# EAGLE design communication (EAGLE 5.06)
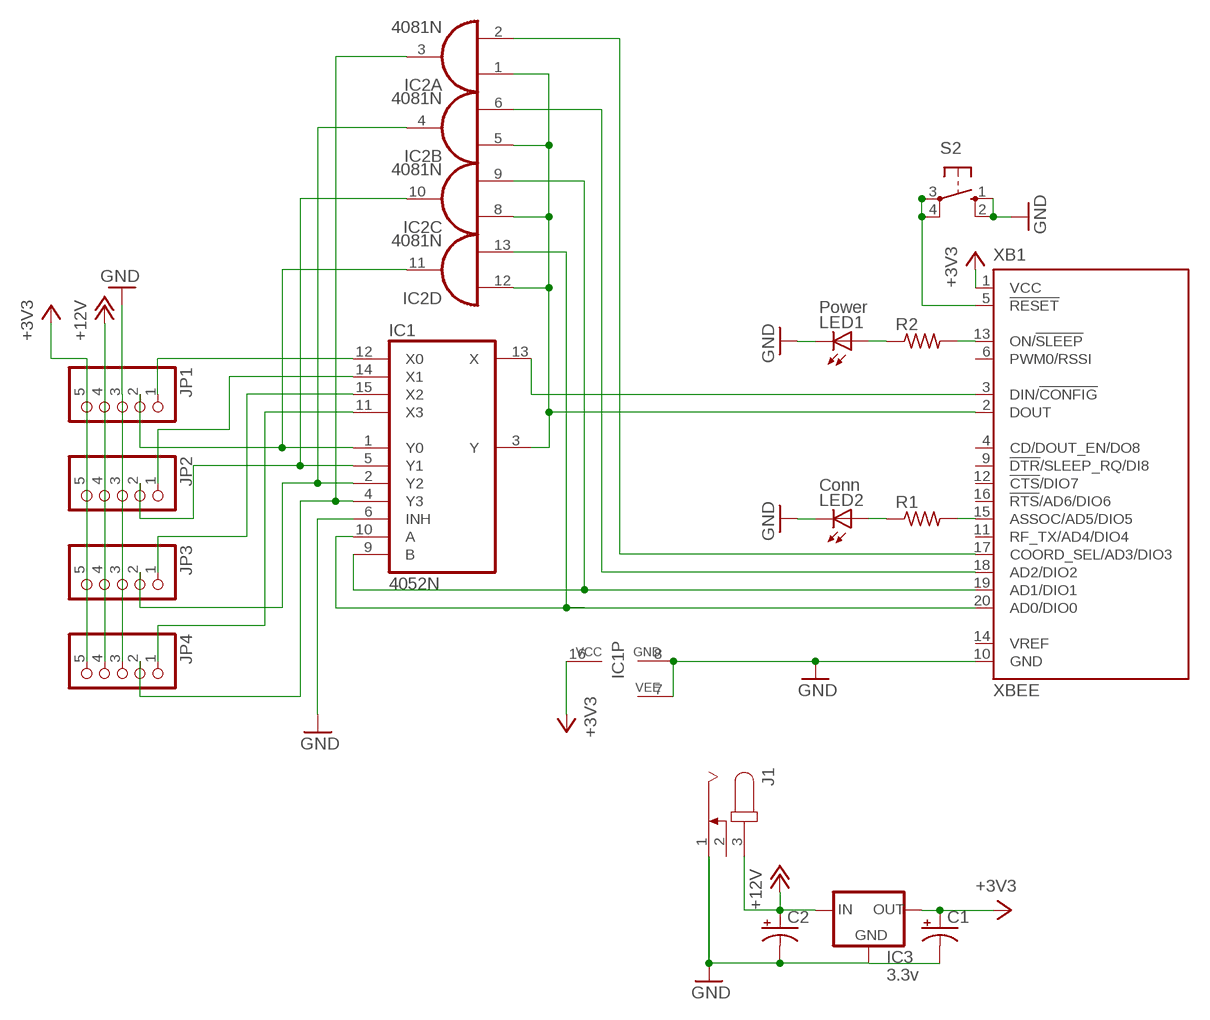
[diagram p0: schematic, sheet 1]

## Parts
C1  CPOL-USE2.5-5  [E2,5-5]
C2  CPOL-USE2.5-5  [E2,5-5]
IC1  4052N  [DIL16]
IC2  4081N  [DIL14]
IC3  3.3v  78XXS  [78XXS]
J1  JACK-PLUG1  [SPC4078]
JP1  PINHD-1X5  [1X05]
JP2  PINHD-1X5  [1X05]
JP3  PINHD-1X5  [1X05]
JP4  PINHD-1X5  [1X05]
LED1  Power  LED3MM  [LED3MM]
LED2  Conn  LED3MM  [LED3MM]
R1  R-US_0309/12  [0309/12]
R2  R-US_0309/12  [0309/12]
S2  10-XX  [B3F-10XX]
XB1  XBEE  [XBEE]

## Nets
+3V3: C1.+ IC1.16(VCC) IC3.OUT JP1.5 JP2.5 JP3.5 JP4.5 XB1.1(VCC)
+12V: C2.+ IC3.IN J1.3 JP1.4 JP2.4 JP3.4 JP4.4
GND: C1.- C2.- IC1.6(INH) IC1.7(VEE) IC1.8(GND) IC3.GND J1.1 JP1.3 JP2.3 JP3.3 JP4.3 LED1.K(C) LED2.K(C) S2.1(S) S2.2(S1) XB1.10(GND)
N$1: IC2.6(B:I1) XB1.18(AD2/DIO2)
N$3: IC1.12(X0) JP1.1
N$4: R1.2 XB1.15(ASSOC/AD5/DIO5)
N$5: LED2.A R1.1
N$6: R2.2 XB1.13(ON/!SLEEP)
N$7: LED1.A R2.1
N$8: S2.3(P) S2.4(P1) XB1.5(!RESET)
N$9: IC1.14(X1) JP2.1
N$11: IC1.15(X2) JP3.1
N$12: IC1.11(X3) JP4.1
N$13: IC1.5(Y1) IC2.10(C:O) JP2.2
N$14: IC1.1(Y0) IC2.11(D:O) JP1.2
N$15: IC1.2(Y2) IC2.4(B:O) JP3.2
N$16: IC1.4(Y3) IC2.3(A:O) JP4.2
N$17: IC1.13(X) XB1.3(DIN/!CONFIG)
N$18: IC1.3(Y) IC2.1(A:I0) IC2.5(B:I0) IC2.8(C:I0) IC2.12(D:I0) XB1.2(DOUT)
N$19: IC1.9(B) IC2.9(C:I1) XB1.19(AD1/DIO1)
N$20: IC1.10(A) IC2.13(D:I1) XB1.20(AD0/DIO0)
N$21: IC2.2(A:I1) XB1.17(COORD_SEL/AD3/DIO3)
Unconnected: J1.2 XB1.4(CD/DOUT_EN/DO8) XB1.6(PWM0/RSSI) XB1.9(!DTR!/SLEEP_RQ/DI8) XB1.11(RF_TX/AD4/DIO4) XB1.12(!CTS!/DIO7) XB1.14(VREF) XB1.16(!RTS!/AD6/DIO6)

## Power pins joined to a net without a drawn wire
VDD: IC2.14(P:VDD)
VSS: IC2.7(P:VSS)

## Library data of the parts
C1 C2 = rcl:CPOL-US: POLARIZED CAPACITOR, American symbol
IC1 = 40xx:4052: Dual 4-channel ANALOG MULTIPLEXER
IC2 = 40xx:4081: Quad 2-input AND
IC3 = v-reg:78XXS: VOLTAGE REGULATOR
J1 = con-jack:JACK-PLUG: DC POWER JACK Power Jack, DC, Right Angle, Through Hole, Rated 5A at 16VDC, PC Terminals Distributor: Farnell (www.Farnell.de) Drawing: 84N1161.pdf / 84N1162.pdf Manufacturer: SPC Technology (www.spctechnology.com) Type: SPC4077 / SPC 4078
JP1-JP4 = pinhead:PINHD-1X5: PIN HEADER
LED1 LED2 = led:LED: LED OSRAM: - CHIPLED LG R971, LG N971, LY N971, LG Q971, LY Q971, LO R971, LY R971 LH N974, LH R974 LS Q976, LO Q976, LY Q976 LO Q996 - Hyper CHIPLED LW Q18S LB Q993, LB Q99A, LB R99A - SideLED LS A670, LO A670, LY A670, LG A670, LP A670 LB A673, LV A673, LT A673, LW A673 LH A674 LY A675 LS A676, LA A676, LO A676, LY A676, LW A676 LS A679, LY A679, LG A679 - Hyper Micro SIDELED® LS Y876, LA Y876, LO Y876, LY Y876 LT Y87S - SmartLED LW L88C, LW L88S LB L89C, LB L89S, LG L890 LS L89K, LO L89K, LY L89K LS L896, LA L896, LO L896, LY L896 - TOPLED LS T670, LO T670, LY T670, LG T670, LP T670 LSG T670, LSP T670, LSY T670, LOP T670, LYG T670 LG T671, LOG T671, LSG T671 LB T673, LV T673, LT T673, LW T673 LH T674 LS T676, LA T676, LO T676, LY T676, LB T676, LH T676, LSB T676, LW T676 LB T67C, LV T67C, LT T67C, LS T67K, LO T67K, LY T67K, LW E67C LS E67B, LA E67B, LO E67B, LY E67B, LB E67C, LV E67C, LT E67C LW T67C LS T679, LY T679, LG T679 LS T770, LO T770, LY T770, LG T770, LP T770 LB T773, LV T773, LT T773, LW T773 LH T774 LS E675, LA E675, LY E675, LS T675 LS T776, LA T776, LO T776, LY T776, LB T776 LHGB T686 LT T68C, LB T68C - Hyper Mini TOPLED® LB M676 - Mini TOPLED Santana® LG M470 LS M47K, LO M47K, LY M47K Source: http://www.osram.convergy.de LUXEON: - LUMILED® LXK2-PW12-R00, LXK2-PW12-S00, LXK2-PW14-U00, LXK2-PW14-V00 LXK2-PM12-R00, LXK2-PM12-S00, LXK2-PM14-U00 LXK2-PE12-Q00, LXK2-PE12-R00, LXK2-PE12-S00, LXK2-PE14-T00, LXK2-PE14-U00 LXK2-PB12-K00, LXK2-PB12-L00, LXK2-PB12-M00, LXK2-PB14-N00, LXK2-PB14-P00, LXK2-PB14-Q00 LXK2-PR12-L00, LXK2-PR12-M00, LXK2-PR14-Q00, LXK2-PR14-R00 LXK2-PD12-Q00, LXK2-PD12-R00, LXK2-PD12-S00 LXK2-PH12-R00, LXK2-PH12-S00 LXK2-PL12-P00, LXK2-PL12-Q00, LXK2-PL12-R00 Source: www.luxeon.com KINGBRIGHT: KA-3528ASYC Source: www.kingbright.com
R1 R2 = resistor:R-US_: RESISTOR, American symbol
S2 = switch-omron:10-XX: OMRON SWITCH
XB1 = maxstream:XBEE: XBee (TM) /XBee-PRO(TM) OEM RF Modules Source: MaxStream, Inc. xbee_productmanual.pdf

## Board
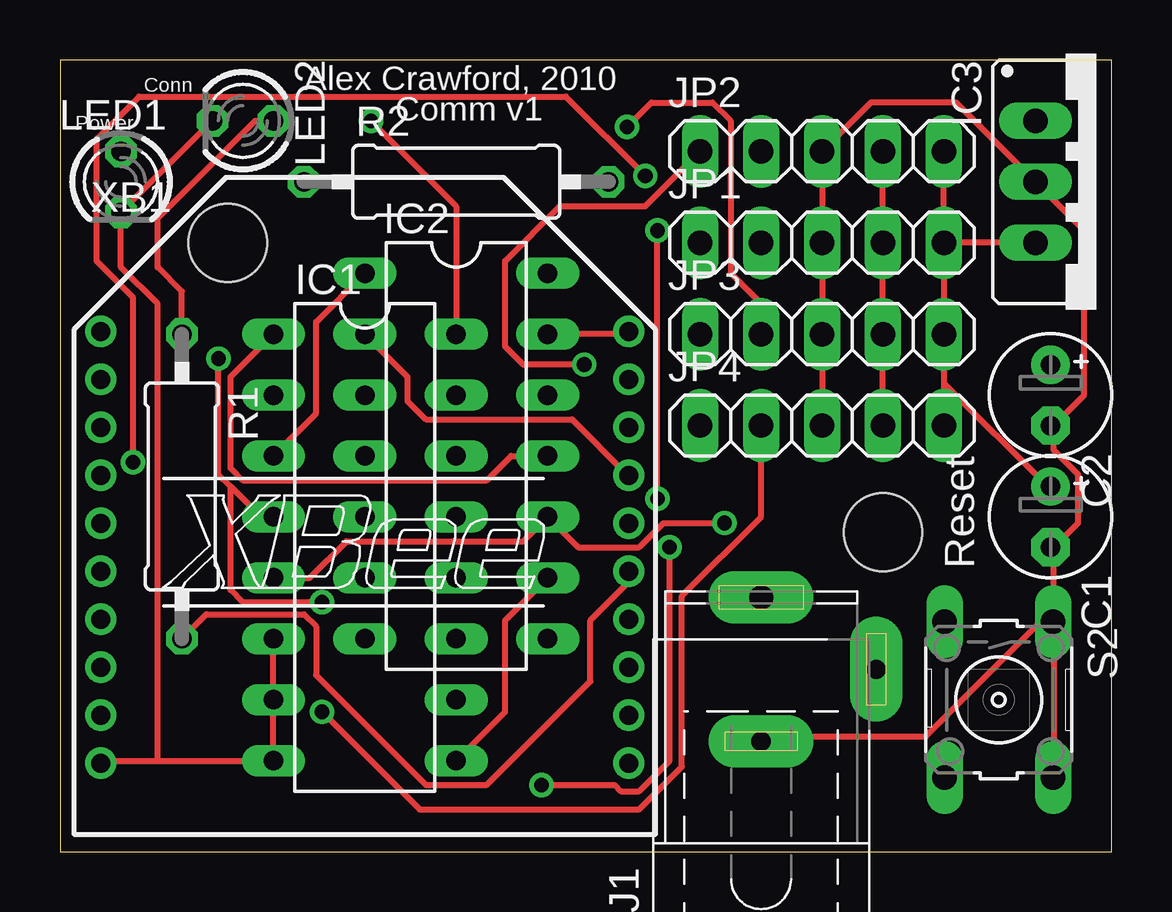
[diagram p1: board, top side]
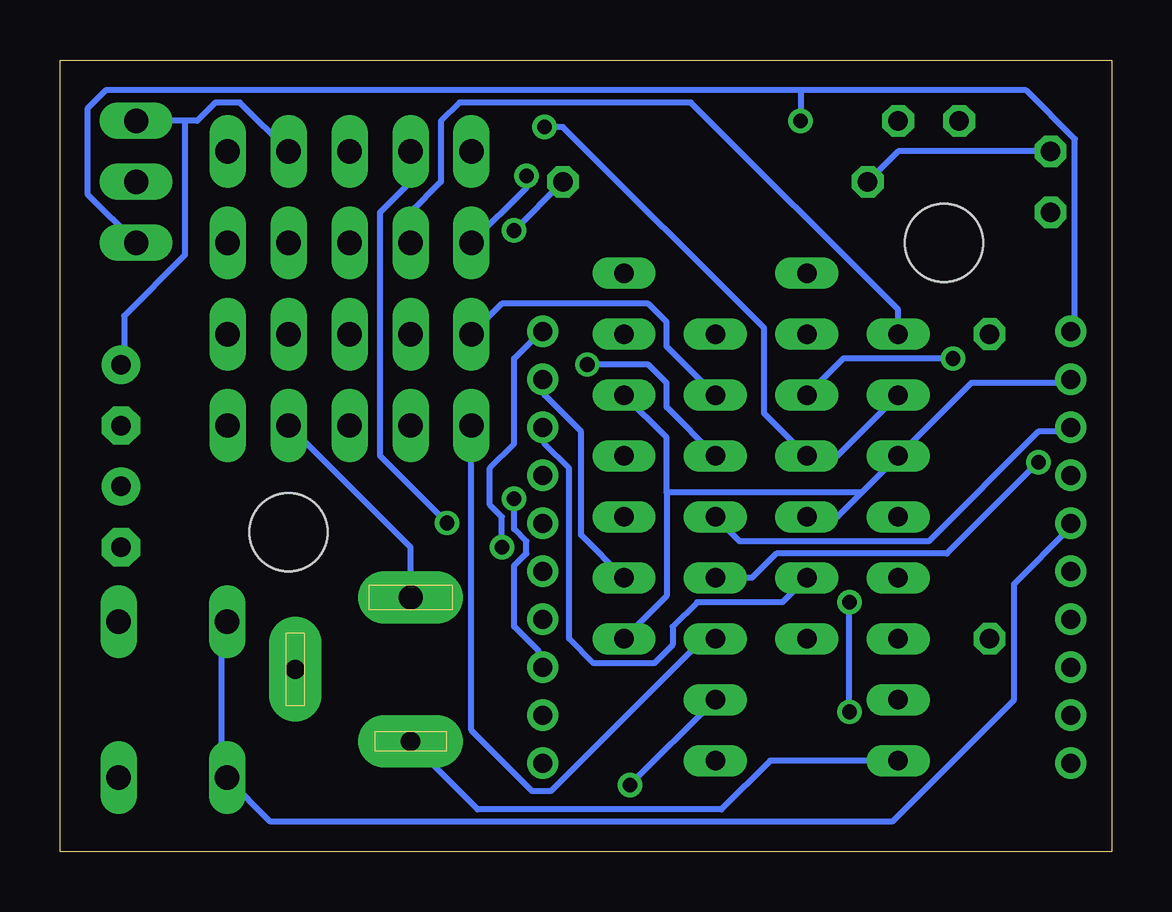
[diagram p2: board, bottom side, seen from below]

Size 43.81 x 33.02 mm. Coordinates in mm from the lower left corner, seen from the top.
Outline: 0,0 43.81,0 43.81,33.02 0,33.02 0,0
Copper layers (1*16): Top 0.035mm / dielectric 1.5mm / Bottom 0.035mm
Design rules "default": minimum track width 10mil, minimum drill 24mil, track to track 8mil, track to pad 8mil, pad to pad 8mil, via to via 8mil, smd to smd 8mil, copper to edge 40mil, drill to drill 8mil, minimum pad ring 10mil, minimum via ring 8mil, stop-mask expansion 4mil, vias tented up to drill 0mil, thermal gap 10mil
Holes 3.26 mm at 6.99,25.4 34.29,13.34

### Footprints (pad centres in the part's own frame; a part is rotated, then mirrored left to right if it is on the bottom)
E2,5-5 = drill 0.813 pad 1.6 round: + -1.27,0 | drill 0.813 pad 1.6 octagon: - 1.27,0
DIL16 = drill 0.813 long: 1 -8.89,-3.81; 2 -6.35,-3.81; 3 -3.81,-3.81; 4 -1.27,-3.81; 5 1.27,-3.81; 6 3.81,-3.81; 7 6.35,-3.81; 8 8.89,-3.81; 9 8.89,3.81; 10 6.35,3.81; 11 3.81,3.81; 12 1.27,3.81; 13 -1.27,3.81; 14 -3.81,3.81; 15 -6.35,3.81; 16 -8.89,3.81
DIL14 = drill 0.813 long: 1 -7.62,-3.81; 2 -5.08,-3.81; 3 -2.54,-3.81; 4 0,-3.81; 5 2.54,-3.81; 6 5.08,-3.81; 7 7.62,-3.81; 8 7.62,3.81; 9 5.08,3.81; 10 2.54,3.81; 11 0,3.81; 12 -2.54,3.81; 13 -5.08,3.81; 14 -7.62,3.81
78XXS = drill 1.016 long: GND 0,-2.54; IN -2.54,-2.54; OUT 2.54,-2.54
SPC4078 = drill 0.8 pad 2.184 long: 1 -3,0; 2 0,-4.8 | drill 1 pad 2.184 long: 3 3,0
1X05 = drill 1.016 long: 1 -5.08,0; 2 -2.54,0; 3 0,0; 4 2.54,0; 5 5.08,0
LED3MM = drill 0.813 octagon: A -1.27,0; K 1.27,0
0309/12 = drill 0.813 octagon: 1 -6.35,0; 2 6.35,0
B3F-10XX = drill 1.016 long: 1 -3.251,2.261; 2 3.251,2.261; 3 -3.251,-2.261; 4 3.251,-2.261
XBEE = drill 0.8 pad 1.27 round: 1 -11,9; 2 -11,7; 3 -11,5; 4 -11,3; 5 -11,1; 6 -11,-1; 7 -11,-3; 8 -11,-5; 9 -11,-7; 10 -11,-9; 11 11,-9; 12 11,-7; 13 11,-5; 14 11,-3; 15 11,-1; 16 11,1; 17 11,3; 18 11,5; 19 11,7; 20 11,9

### Placement (x,y rotation side)
C1  41.27,13.97 270 top
C2  41.27,19.05 270 top
IC1  12.7,12.7 270 top
IC2  16.51,16.51 270 top
IC3  43.18,27.94 270 top
J1  29.21,7.62 90 top
JP1  31.75,25.4 0 top
JP2  31.75,29.21 0 top
JP3  31.75,21.59 0 top
JP4  31.75,17.78 0 top
LED1  2.54,27.94 270 top
LED2  7.62,30.48 180 top
R1  5.08,15.24 270 top
R2  16.51,27.94 0 top
S2  39.12,6.35 270 top
XB1  12.7,12.7 0 top

### Tracks (layer width: path | path; a pad name or v marks a point on that pad's centre or on a via)
+3V3  (via drill 0.61)
  Top 0.254: 36.83,19.56 JP3.5 JP1.5 | 36.83,19.56 JP4.5 | 36.83,19.56 41.15,15.24 C1.+ | JP1.5 JP2.5 | IC1.16 16.51,26.92 v12.95,30.48 | IC3.OUT JP1.5
  Bottom 0.254: 12.95,31.75 41.91,31.75 42.67,30.99 42.67,27.43 IC3.OUT | 12.95,31.75 3.56,31.75 1.52,29.72 1.52,21.84 XB1.1 | 12.95,31.75 v12.95,30.48
+12V
  Top 0.254: JP4.4 JP3.4 JP1.4 JP2.4
  Bottom 0.254: 38.61,30.48 38.1,30.48 37.34,31.24 36.32,31.24 JP2.4 | 38.61,30.48 IC3.IN | 38.61,30.48 38.61,24.89 41.15,22.35 41.15,20.32 C2.+ | JP4.4 29.21,12.7 J1.3
GND
  Top 0.254: LED2.K LED1.K 2.54,24.38 4.06,22.86 4.06,3.81 | IC1.6 IC1.7 IC1.8 4.06,3.81 | 4.06,3.81 1.78,3.81 XB1.10 | JP4.3 JP3.3 JP1.3 JP2.3 33.78,31.24 37.34,31.24 IC3.GND 42.67,25.91 42.67,19.05 41.4,17.78 | S2.2 41.4,3.3 41.4,9.4 S2.1 | 41.4,10.16 41.4,9.65 S2.1 | 41.4,10.16 41.4,12.7 | 41.4,17.78 41.4,16.76 42.42,15.75 42.42,13.72 41.4,12.7 | 41.4,12.7 C1.- | 41.4,10.16 36.07,4.83 29.21,4.83 J1.1 | 41.4,10.16 S2.1 | 41.4,17.78 C2.-
  Bottom 0.254: IC1.8 14.22,3.81 16.26,1.78 26.42,1.78 29.21,4.57 J1.1
N$1
  Bottom 0.254: IC2.6 13.72,10.41 17.27,10.41 18.29,9.4 18.29,8.64 19.05,7.87 21.59,7.87 22.61,8.89 22.61,16 23.62,17.02 23.62,17.53 XB1.18
N$3  (via drill 0.61)
  Top 0.254: v3.05,16.26 3.05,23.11 1.52,24.64 1.52,29.72 3.3,31.5 21.08,31.5 v24.38,28.19
  Bottom 0.254: IC1.12 14.99,11.43 13.97,12.45 6.86,12.45 v3.05,16.26 | v24.38,28.19 24.38,27.69 JP1.1
N$4
  Top 0.254: R1.2 6.1,9.91 10.16,9.91 10.67,9.4 10.67,7.37 15.24,2.79 17.78,2.79 22.1,7.11 22.1,9.65 23.62,11.18 23.62,11.68 XB1.15
N$5
  Top 0.254: R1.1 5.08,23.37 4.06,24.38 4.06,26.42 8.13,30.48 LED2.A
N$6  (via drill 0.61)
  Top 0.254: v24.89,14.73 v24.89,25.91
  Bottom 0.254: v24.89,14.73 24.89,13.46 24.38,12.95 24.38,12.45 24.89,11.94 24.89,9.4 23.88,8.38 23.88,7.87 XB1.13 | v24.89,25.91 R2.2
N$7
  Bottom 0.254: LED1.A 8.89,29.21 R2.1
N$8
  Bottom 0.254: XB1.5 1.78,13.46 4.06,11.18 4.06,6.35 9.14,1.27 35.05,1.27 36.83,3.05 S2.4 37.08,3.3 37.08,9.4 S2.3
N$9  (via drill 0.61)
  Top 0.254: v21.84,20.32 19.3,20.32 18.54,21.08 18.54,24.64 20.83,26.92 24.38,26.92 JP2.1
  Bottom 0.254: IC1.14 18.54,18.54 18.54,19.56 19.3,20.32 v21.84,20.32
N$11
  Bottom 0.254: IC1.15 18.54,21.08 18.54,22.1 19.3,22.86 25.4,22.86 JP3.1
N$12
  Bottom 0.254: IC1.11 17.02,8.89 23.37,2.54 24.13,2.54 26.67,5.08 JP4.1
N$13  (via drill 0.61)
  Top 0.254: IC1.5 10.41,11.43 11.94,12.95 19.3,12.95 IC2.10 21.59,12.7 24.13,12.7 25.15,13.72 v27.69,13.72
  Bottom 0.254: JP2.2 29.21,27.94 30.48,26.67 30.48,16.51 v27.69,13.72
N$14
  Top 0.254: IC2.11 18.8,16.51 17.78,15.49 7.62,15.49 7.11,16 7.11,19.81 IC1.1
  Bottom 0.254: JP1.2 29.21,26.67 27.94,27.94 27.94,30.48 27.18,31.24 17.53,31.24 8.89,22.61 IC1.1
N$15  (via drill 0.61)
  Top 0.254: JP3.2 29.21,22.86 27.94,24.13 27.94,30.48 27.18,31.24 24.64,31.24 v23.62,30.23
  Bottom 0.254: IC1.2 11.43,16.51 IC2.4 14.48,18.29 14.48,21.84 22.86,30.23 v23.62,30.23
N$16  (via drill 0.61)
  Top 0.254: IC1.4 8.38,13.97 7.11,15.24 | 7.11,15.24 6.6,15.75 v6.6,20.57 | JP4.2 29.21,13.97 25.91,10.67 25.91,3.56 24.13,1.78 14.99,1.78 v10.92,5.84 | v10.92,10.41 7.62,10.41 7.11,10.92 7.11,15.24
  Bottom 0.254: v6.6,20.57 11.18,20.57 IC2.3 | v10.92,5.84 v10.92,10.41
N$17
  Bottom 0.254: IC1.13 15.49,12.95 7.62,12.95 3.05,17.53 1.78,17.53 XB1.3
N$18
  Top 0.254: IC2.1 10.67,22.1 10.67,18.29 IC1.3
  Bottom 0.254: IC2.8 18.54,10.67 18.54,14.99 | 18.54,14.99 18.54,17.27 IC2.12 | XB1.2 1.78,19.56 5.84,19.56 IC1.3 10.41,14.99 | IC2.5 11.43,13.97 10.41,14.99 | 10.41,14.99 18.54,14.99
N$19
  Top 0.254: IC1.9 18.54,5.84 18.54,9.65 IC2.9
  Bottom 0.254: IC2.9 22.1,13.21 22.1,17.53 23.62,19.05 23.62,19.56 XB1.19
N$20  (via drill 0.61)
  Top 0.254: IC2.13 23.62,21.59 XB1.20 | v20.07,2.79 23.11,2.79 23.37,2.54 24.13,2.54 25.4,3.81 v25.4,12.7
  Bottom 0.254: IC1.10 v20.07,2.79 | v25.4,12.7 25.4,13.97 25.91,14.48 25.91,16 24.89,17.02 24.89,20.57 23.88,21.59 XB1.20
N$21
  Top 0.254: IC2.2 14.48,19.81 14.48,18.8 15.24,18.03 21.34,18.03 23.62,15.75 XB1.17

### Text on the board
tPlace: Alex Crawford, 2010 | Comm v1 | Reset
tValues: +